# Altium schematic sheet Illustrations 1.SchDoc: Illustrations 1
size A4; ApprovedBy: LD Stanton; Author: LD Stanton; CompanyName: University of Cape Town; DrawnBy: Lawrence Stanton; Engineer: Lawrence Stanton; Organization: University of Cape Town; Address1: Department of Electrical Engineering; Address2: Rondebosch; Address3: Cape Town; Address4: South Africa 7701; DocumentNumber: 3; SheetNumber: 3; SheetTotal: 4
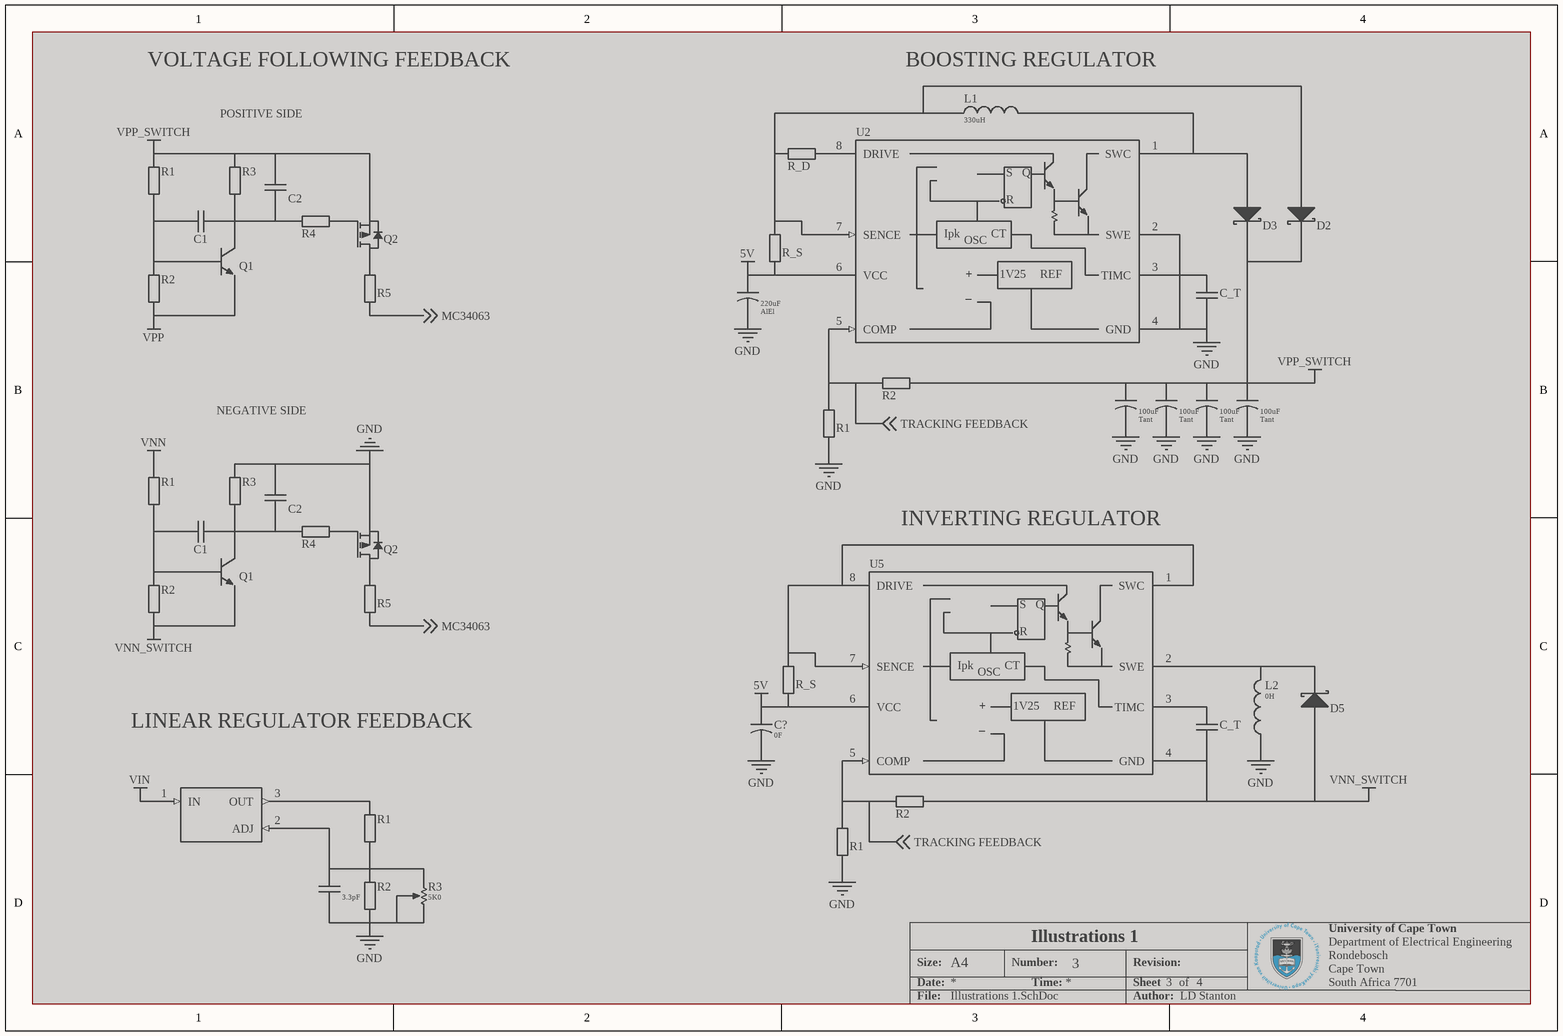
[diagram p0: Illustrations 1.SchDoc]

## Parts
(Parts that share a designator on the sheet are numbered #1, #2 ... from top to bottom, then left to right.)
C1#1  Capacitor Non-Polarised Illustration  (value not drawn)  (graphical)  (masked out: inside a compile mask, not in the netlist)
C1#2  Capacitor Non-Polarised Illustration  (value not drawn)  (graphical)  (masked out: inside a compile mask, not in the netlist)
C2#1  Capacitor Non-Polarised Illustration  (value not drawn)  (graphical)  (masked out: inside a compile mask, not in the netlist)
C2#2  Capacitor Non-Polarised Illustration  (value not drawn)  (graphical)  (masked out: inside a compile mask, not in the netlist)
C?#1  value 220uF  Dielectric: AlEl  (hidden comment: Capacitor Polarised Illustration)  (graphical)  (masked out: inside a compile mask, not in the netlist)
C?#2  value 100uF  Dielectric: Tant  (hidden comment: Capacitor Polarised Illustration)  (graphical)  (masked out: inside a compile mask, not in the netlist)
C?#3  value 100uF  Dielectric: Tant  (hidden comment: Capacitor Polarised Illustration)  (graphical)  (masked out: inside a compile mask, not in the netlist)
C?#4  value 100uF  Dielectric: Tant  (hidden comment: Capacitor Polarised Illustration)  (graphical)  (masked out: inside a compile mask, not in the netlist)
C?#5  value 100uF  Dielectric: Tant  (hidden comment: Capacitor Polarised Illustration)  (graphical)  (masked out: inside a compile mask, not in the netlist)
C?#6  value 0F  (hidden comment: Capacitor Polarised Illustration)  (graphical)  (masked out: inside a compile mask, not in the netlist)
C?#7  value 3.3pF  (hidden comment: Capacitor Non-Polarised Illustration)  (graphical)  (masked out: inside a compile mask, not in the netlist)
C_T#1  Capacitor Non-Polarised Illustration  (value not drawn)  (graphical)  (masked out: inside a compile mask, not in the netlist)
C_T#2  Capacitor Non-Polarised Illustration  (value not drawn)  (graphical)  (masked out: inside a compile mask, not in the netlist)
D2  Schottky Diode Illustration  (value not drawn)  (graphical)  (masked out: inside a compile mask, not in the netlist)
D3  Schottky Diode Illustration  (value not drawn)  (graphical)  (masked out: inside a compile mask, not in the netlist)
D5  Schottky Diode Illustration  (value not drawn)  (graphical)  (masked out: inside a compile mask, not in the netlist)
L1  value 330uH  (hidden comment: Inductor Illustration)  (graphical)  (masked out: inside a compile mask, not in the netlist)
L2  value 0H  (hidden comment: Inductor Illustration)  (graphical)  (masked out: inside a compile mask, not in the netlist)
Q1#1  BJT NPN Illustration  (value not drawn)  (graphical)  (masked out: inside a compile mask, not in the netlist)
Q1#2  BJT NPN Illustration  (value not drawn)  (graphical)  (masked out: inside a compile mask, not in the netlist)
Q2#1  MOSFET P-Channel Illustration  (value not drawn)  (graphical)  (masked out: inside a compile mask, not in the netlist)
Q2#2  MOSFET P-Channel Illustration  (value not drawn)  (graphical)  (masked out: inside a compile mask, not in the netlist)
R1#1  Resistor Box Illustration  (value not drawn)  (graphical)  (masked out: inside a compile mask, not in the netlist)
R1#2  Resistor Box Illustration  (value not drawn)  (graphical)  (masked out: inside a compile mask, not in the netlist)
R1#3  Resistor Box Illustration  (value not drawn)  (graphical)  (masked out: inside a compile mask, not in the netlist)
R1#4  Resistor Box Illustration  (value not drawn)  (graphical)  (masked out: inside a compile mask, not in the netlist)
R1#5  Resistor Box Illustration  (value not drawn)  (graphical)  (masked out: inside a compile mask, not in the netlist)
R2#1  Resistor Box Illustration  (value not drawn)  (graphical)  (masked out: inside a compile mask, not in the netlist)
R2#2  Resistor Box Illustration  (value not drawn)  (graphical)  (masked out: inside a compile mask, not in the netlist)
R2#3  Resistor Box Illustration  (value not drawn)  (graphical)  (masked out: inside a compile mask, not in the netlist)
R2#4  Resistor Box Illustration  (value not drawn)  (graphical)  (masked out: inside a compile mask, not in the netlist)
R2#5  Resistor Box Illustration  (value not drawn)  (graphical)  (masked out: inside a compile mask, not in the netlist)
R3#1  Resistor Box Illustration  (value not drawn)  (graphical)  (masked out: inside a compile mask, not in the netlist)
R3#2  Resistor Box Illustration  (value not drawn)  (graphical)  (masked out: inside a compile mask, not in the netlist)
R3#3  value 5K0  (hidden comment: Potentiometer Illustration)  (graphical)  (masked out: inside a compile mask, not in the netlist)
R4#1  Resistor Box Illustration  (value not drawn)  (graphical)  (masked out: inside a compile mask, not in the netlist)
R4#2  Resistor Box Illustration  (value not drawn)  (graphical)  (masked out: inside a compile mask, not in the netlist)
R5#1  Resistor Box Illustration  (value not drawn)  (graphical)  (masked out: inside a compile mask, not in the netlist)
R5#2  Resistor Box Illustration  (value not drawn)  (graphical)  (masked out: inside a compile mask, not in the netlist)
R_D  Resistor Box Illustration  (value not drawn)  (graphical)  (masked out: inside a compile mask, not in the netlist)
R_S#1  Resistor Box Illustration  (value not drawn)  (graphical)  (masked out: inside a compile mask, not in the netlist)
R_S#2  Resistor Box Illustration  (value not drawn)  (graphical)  (masked out: inside a compile mask, not in the netlist)
U2  MC34063 Illustration  (value not drawn)  (graphical)  (masked out: inside a compile mask, not in the netlist)
U5  MC34063 Illustration  (value not drawn)  (graphical)  (masked out: inside a compile mask, not in the netlist)
U?  Linear Regulator Adjustible Illustration  (value not drawn)  (graphical)  (masked out: inside a compile mask, not in the netlist)

## Notes on the sheet
- POSITIVE SIDE
- VOLTAGE FOLLOWING FEEDBACK
- (near L1) BOOSTING REGULATOR
- NEGATIVE SIDE
- INVERTING REGULATOR
- LINEAR REGULATOR FEEDBACK
- Size:
- Date:
- A4
- Number:
- Time:
- Revision:
- Sheet
- of
- File:
- Author:
- (in symbol CMP-000014-1) S; Q; R; Ipk; CT; OSC; +; 1V25; REF; _

## Library data of the parts
C1#1 C1#2 C2#1 C2#2 C_T#1 C_T#2 = CMP-000003-10: Non-Polarised Capacitor for Illustration.; Value: 0F; Tolerance: ±0%; Temperature Coefficient: ±0ppm/K; Placement: CRITICAL; Voltage: 0V; Package: 0000; Temperature: -0 - 0°C
C?#1-C?#5 = CMP-000004-8: Polarised Capacitor for Illustration; Temperature Coefficient: ±0ppm/K; Tolerance: ±0%; Voltage: 0V; Placement: CRITICAL; Temperature: -0 - 0°C; Package: 0000
C?#6 = CMP-000004-7: Polarised Capacitor for Illustration; Placement: CRITICAL; Tolerance: ±0%; Voltage: 0V; Temperature Coefficient: ±0ppm/K; Package: 0000; Temperature: -0 - 0°C
C?#7 = CMP-000003-10: Non-Polarised Capacitor for Illustration.; Tolerance: ±0%; Temperature Coefficient: ±0ppm/K; Placement: CRITICAL; Voltage: 0V; Package: 0000; Temperature: -0 - 0°C
D2 D3 D5 = CMP-00003-4: Schottky Diode for Ilustration; Blocking Voltage: 0V0; Forward Current: 0A0; Placement: CRITICAL; Temperature: -0 - 0°C; Forward Voltage: 0V0
L1 L2 = CMP-000009-4: General Inductor for Illustration; Rated Current: 0A; Tolerance: ±0%; Temperature Coefficient: ±0ppm/K; Placement: CRITICAL; Resistance: 0K0; Temperature: -0 - 0°C; Saturation Current: 0A
Q1#1 Q1#2 = CMP-000010-2: NPN Bipolar Junction Transistor for Illustration; Collector Current: 0A; Power: 0W; Collector-Emitter Voltage: 0V; Placement: CRITICAL; Saturation Voltgae: 0V; Temperature: -0 - 0°C
Q2#1 Q2#2 = CMP-00001-3: P-Channel MOSFET 3-Terminal for Illustration; Drain-Source Voltage: 0V; Current: 0A; Placement: CRITICAL; Gate-Source Voltage: 0V; Gate Threshold Voltage: 0V; Temperature: -0 - 0°C
R1#1-R1#5 R2#1-R2#5 R3#1 R3#2 R4#1 R4#2 R5#1 R5#2 R_D R_S#1 R_S#2 = CMP-010-000360-14: Resistor for Illustration. Box Symbol.; Value: 0K0; Working Voltage: 0V; Power: 0W; Placement: CRITICAL; Tolerance: ±0%; Temperature Coefficient: ±0ppm/K; Package: 0000; Temperature: -0 - 0°C
R3#3 = CMP-010-000362-3: Potentiometer for Illustration.; Working Voltage: 0V; Placement: CRITICAL; Power: 0W; Temperature Coefficient: ±0ppm/K; Tolerance: ±0%; Temperature: -0 - 0°C
U2 U5 = CMP-000014-1: MC34063A for Illustration; Placement: CRITICAL
U? = CMP-000013-1: Adjustible Linear Regulator for Illustration